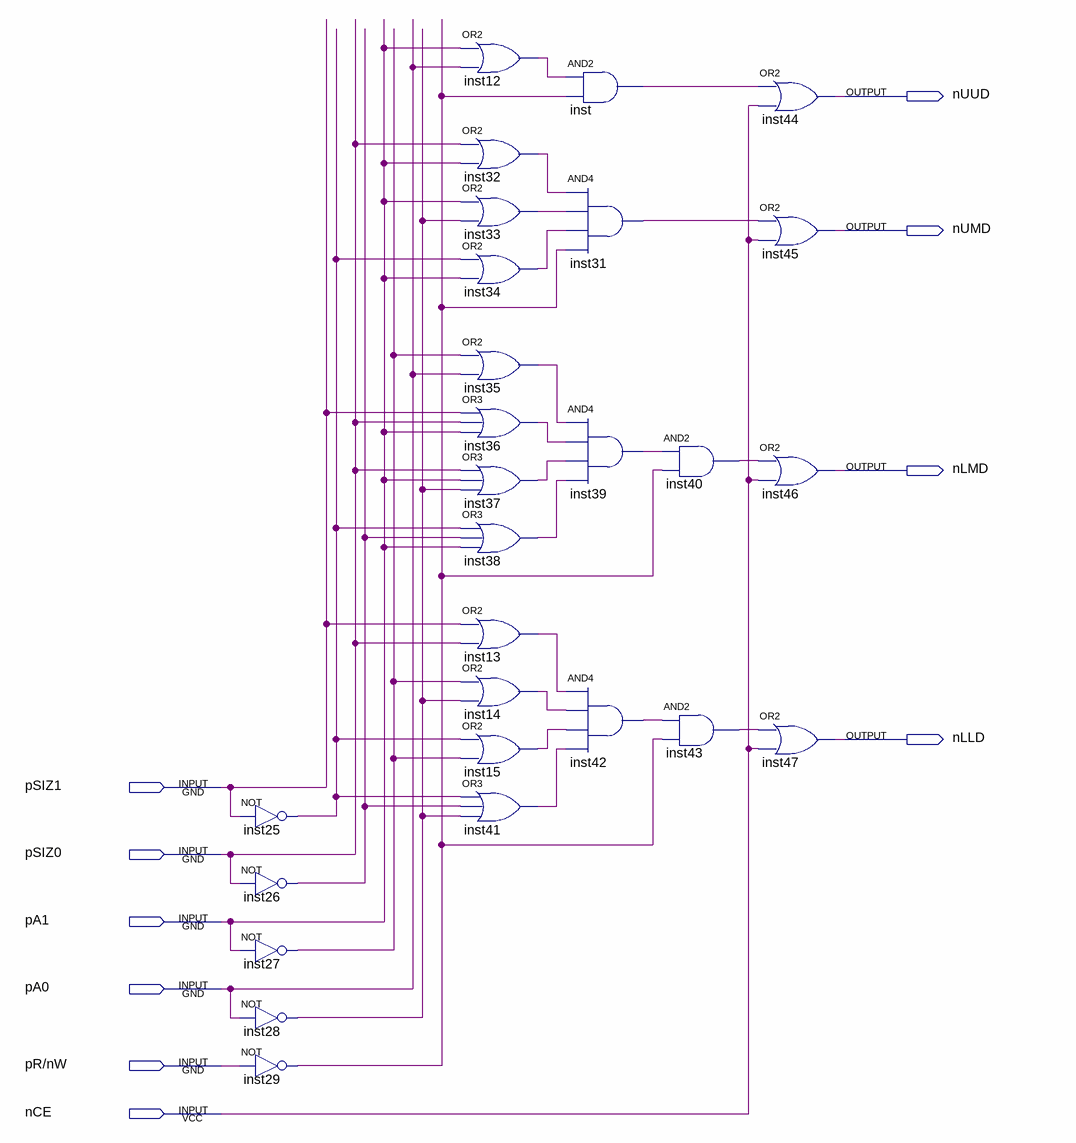
[diagram p0: schematic sheet]
// Quartus schematic BusEnable030.bdf as structural Verilog: 27 symbols, 10 pins
module BusEnable030 (
  input  pSIZ1,
  input  pSIZ0,
  input  pA1,
  input  pA0,
  input  \pR/nW ,
  input  nCE,
  output nUUD,
  output nUMD,
  output nLMD,
  output nLLD
);

  wire inst12_out, inst13_out, inst14_out, inst15_out, inst25_out, inst26_out, inst27_out, inst28_out,
       inst29_out, inst31_out, inst32_out, inst33_out, inst34_out, inst35_out, inst36_out, inst37_out,
       inst38_out, inst39_out, inst40_out, inst41_out, inst42_out, inst43_out, inst_out;

  not inst25 (inst25_out, pSIZ1);
  not inst26 (inst26_out, pSIZ0);
  not inst27 (inst27_out, pA1);
  not inst28 (inst28_out, pA0);
  not inst29 (inst29_out, \pR/nW );
  or inst12 (inst12_out, pA1, pA0);
  or inst32 (inst32_out, pSIZ0, pA1);
  or inst33 (inst33_out, pA1, inst28_out);
  or inst34 (inst34_out, inst25_out, pA1);
  or inst35 (inst35_out, inst27_out, pA0);
  or inst36 (inst36_out, pSIZ1, pSIZ0, pA1);
  or inst37 (inst37_out, pSIZ0, pA1, inst28_out);
  or inst38 (inst38_out, inst25_out, inst26_out, pA1);
  or inst13 (inst13_out, pSIZ1, pSIZ0);
  or inst14 (inst14_out, inst27_out, inst28_out);
  or inst15 (inst15_out, inst25_out, inst27_out);
  or inst41 (inst41_out, inst25_out, inst26_out, inst28_out);
  and inst (inst_out, inst12_out, inst29_out);
  and inst31 (inst31_out, inst32_out, inst33_out, inst34_out, inst29_out);
  and inst39 (inst39_out, inst35_out, inst36_out, inst37_out, inst38_out);
  and inst42 (inst42_out, inst13_out, inst14_out, inst15_out, inst41_out);
  and inst40 (inst40_out, inst39_out, inst29_out);
  and inst43 (inst43_out, inst42_out, inst29_out);
  or inst44 (nUUD, inst_out, nCE);
  or inst45 (nUMD, inst31_out, nCE);
  or inst46 (nLMD, inst40_out, nCE);
  or inst47 (nLLD, inst43_out, nCE);
endmodule
